# Altium project Pinger-V2.PrjPcb (part 1 of 2)
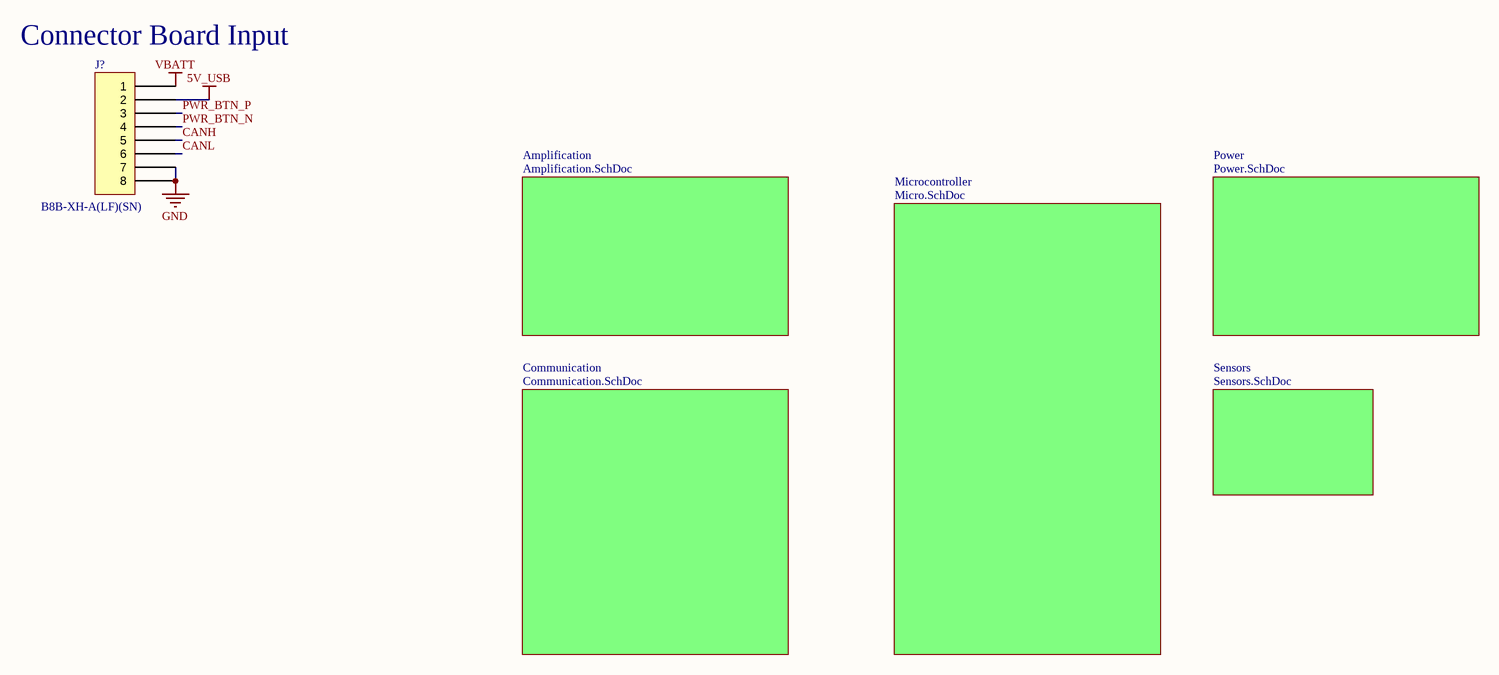
[diagram p0: Master.SchDoc]
Project: Pinger V2
5 sheets, 87 parts. Net scope: flat (ports and power ports of the same name join across sheets).
Board file: Pinger-V2 PCB.PcbDoc
Sheets:
  Master.SchDoc
    Microcontroller = Micro.SchDoc
    Power = Power.SchDoc
    Sensors = Sensors.SchDoc
    Communication = Communication.SchDoc

## Sheet Master.SchDoc
size 431 x 279 mm; SheetNumber: 1; SheetTotal: 6

### Parts
(Parts that share a designator on the sheet are numbered #1, #2 ... from top to bottom, then left to right.)
J?#1  B8B-XH-A(LF)(SN)  [JST XH B8B-XH-A]

### Sub-sheets
Amplification = Amplification.SchDoc (file not in this document): no entries
Communication = Communication.SchDoc: no entries
Microcontroller = Micro.SchDoc: no entries
Power = Power.SchDoc: no entries
Sensors = Sensors.SchDoc: no entries

### Nets
5V_USB: J?#1.2
GND: J?#1.7 J?#1.8
VBATT: J?#1.1
CANH: J?#1.5
CANL: J?#1.6
PWR_BTN_N: J?#1.4
PWR_BTN_P: J?#1.3

### Notes on the sheet
- (near J?#1) Connector Board Input
- DWG. NO.
- REV.
- SHT.
- THIS DOCUMENT AND THE DATA DISCLOSED HEREIN OR HEREWITH IS THE PROPERTY OF ALTIUM LIMITED AND MAY BE FREELY DISTRIBUTED IN WHOLE. NO RIGHTS ARE RESERVED OR EXPRESS OR IMPLIED WARANTEE GIVEN.
- REVISION
- DESCRIPTION
- DATE
- APPROVED
- ENG:
- APPROVALS
- PROJECT
- DSN:
- CHK:
- REFERENCE DOCUMENTS
- PROJECT REVISION:
- TITLE
- DOCUMENT REVISION:
- DESIGN ITEM:
- BOM:
- FAB DWG:
- PCB DWG:
- ASSY DWG:
- SCALE:
- SIZE
- B
- CAGE CODE
- FILE NAME
- DWG NO.
- SHEET
- OF
- REV

### Library data of the parts
J?#1 = B8B-XH-A(LF)(SN): CONN HEADER VERT 8POS 2.5MM; Manufacturer: JST Sales America Inc.; Contact Length - Post: 0.134" (3.40mm); Current Rating (Amps): 3A; Material Flammability Rating: UL94 V-0; Number of Positions: 8; Number of Positions Loaded: All; Pitch - Mating: 0.098" (2.50mm); Shrouding: Shrouded - 4 Wall; Style: Board to Cable/Wire; Voltage Rating: 250V; Part Number: B8B-XH-A(LF)(SN); ComponentLink1Description: Datasheet; ComponentLink1URL: http://www.jst-mfg.com/product/pdf/eng/eXH.pdf; ComponentLink2Description: DigiKey Link; ComponentLink2URL: http://digikey.com/product-detail/en/jst-sales-america-inc/B8B-XH-A-LF-SN/455-2251-ND/1651049; Connector Type: Header; Contact Finish - Mating: Tin; Contact Finish - Post: Tin; Contact Material: Brass; Contact Shape: Square; Contact Type: Male Pin; Fastening Type: Detent Lock; Insulation Color: Natural; Insulation Height: 0.276" (7.00mm); Insulation Material: Polyamide (PA66), Nylon 6/6; LastUpdated: 2020-01-12 11:47:22 PM; Lifecycle Status: Active; Minimum Order: 1; Mounting Type: Through Hole; Number of Rows: 1; Operating Temperature: -25°C ~ 85°C; Packaging: Bulk; PartId: 73; Part Status: Active; Price: 0.36; Series: XH; Supplier 1: DigiKey; Supplier Part Number 1: 455-2251-ND; Termination: Press-Fit, Solder

## Sheet Micro.SchDoc
size 431 x 279 mm; SheetNumber: 3; SheetTotal: 6
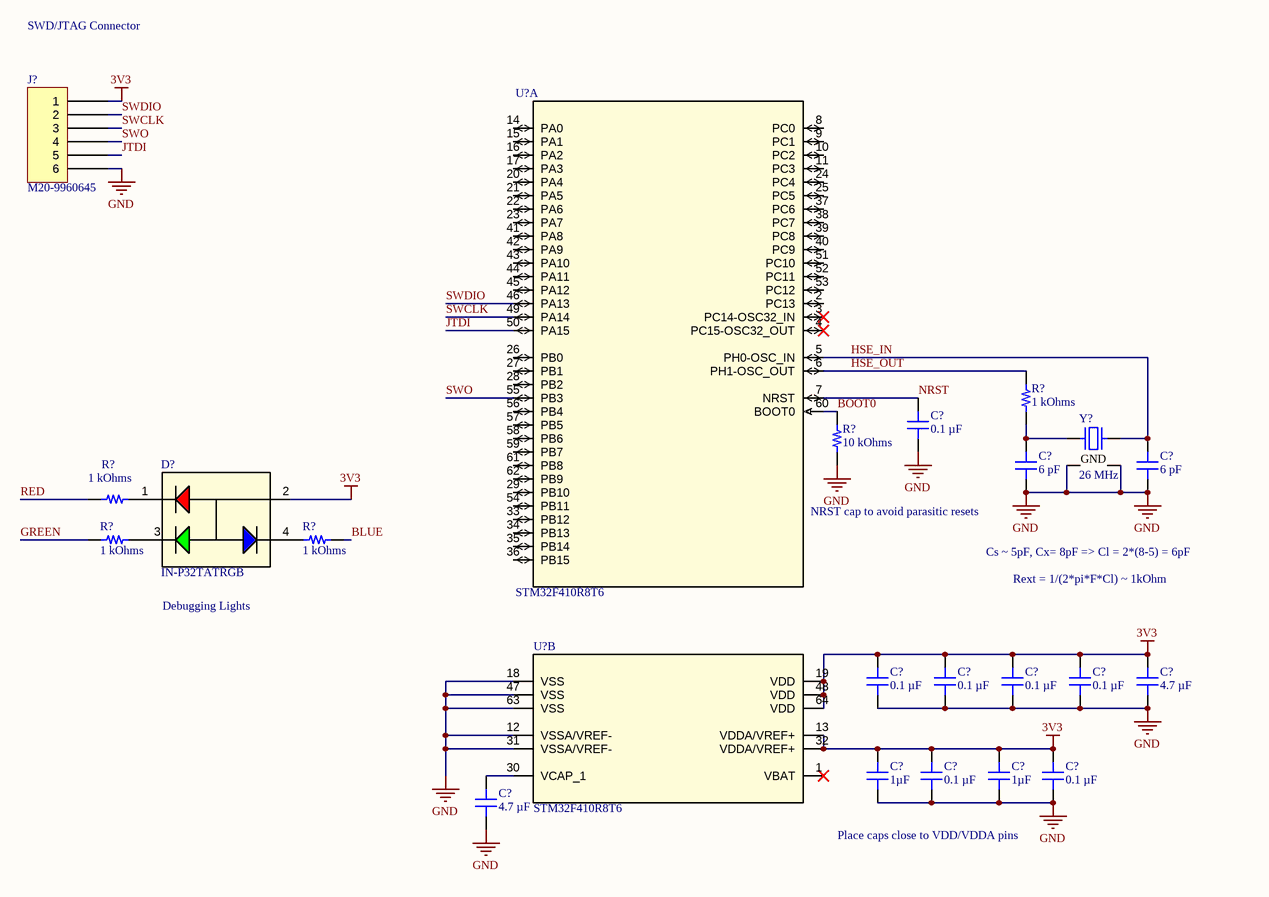
[diagram p1: Micro.SchDoc]

### Parts
(Parts that share a designator on the sheet are numbered #1, #2 ... from top to bottom, then left to right.)
C?#1  0.1 µF  [CAP 0603_1608]
C?#2  6 pF  [CAP 0603_1608]
C?#3  6 pF  [CAP 0603_1608]
C?#4  0.1 µF  [CAP 0603_1608]
C?#5  0.1 µF  [CAP 0603_1608]
C?#6  0.1 µF  [CAP 0603_1608]
C?#7  0.1 µF  [CAP 0603_1608]
C?#8  4.7 µF  [CAP 0603_1608]
C?#9  1µF  [CAP 0603_1608]
C?#10  0.1 µF  [CAP 0603_1608]
C?#11  1µF  [CAP 0603_1608]
C?#12  0.1 µF  [CAP 0603_1608]
C?#13  4.7 µF  [CAP 0603_1608]
D?#1  IN-P32TATRGB  [IN-P32TATRGB-Footprint-1]
J?#2  M20-9960645  [HARWIN M20-9960645]
R?#1  1 kOhms  [RES 0603_1608]
R?#2  10 kOhms  [RES 0603_1608]
R?#3  1 kOhms  [RES 0603_1608]
R?#4  1 kOhms  [RES 0603_1608]
R?#5  1 kOhms  [RES 0603_1608]
U?#1  STM32F410R8T6  [STM32F410R8T6-Footprint-1]  (part A of 2)
U?#2  STM32F410R8T6  [STM32F410R8T6-Footprint-1]  (part B of 2)
Y?  26 MHz  [NDK NX3225GA]

### Nets
3V3: C?#4.2 C?#5.2 C?#6.2 C?#7.2 C?#8.2 C?#9.2 C?#10.2 C?#11.2 C?#12.2 D?#1.2 J?#2.1 U?#2.13(VDDA/VREF+) U?#2.19(VDD) U?#2.32(VDDA/VREF+) U?#2.48(VDD) U?#2.64(VDD)
GND: C?#1.1 C?#2.1 C?#3.1 C?#4.1 C?#5.1 C?#6.1 C?#7.1 C?#8.1 C?#9.1 C?#10.1 C?#11.1 C?#12.1 C?#13.1 J?#2.6 R?#2.1 U?#2.12(VSSA/VREF-) U?#2.18(VSS) U?#2.31(VSSA/VREF-) U?#2.47(VSS) U?#2.63(VSS) Y?.2(GND) Y?.4(GND)
BLUE: R?#5.2
BOOT0: R?#2.2 U?#1.60(BOOT0)
GREEN: R?#4.1
HSE_IN: C?#3.2 U?#1.5(PH0-OSC_IN) Y?.3
HSE_OUT: R?#1.2 U?#1.6(PH1-OSC_OUT)
JTDI: J?#2.5 U?#1.50(PA15)
NRST: C?#1.2 U?#1.7(NRST)
RED: R?#3.1
SWCLK: J?#2.3 U?#1.49(PA14)
SWDIO: J?#2.2 U?#1.46(PA13)
SWO: J?#2.4 U?#1.55(PB3)
NetC?#2_2: C?#2.2 R?#1.1 Y?.1
NetC?#13_2: C?#13.2 U?#2.30(VCAP_1)
NetD?#1_1: D?#1.1 R?#3.2
NetD?#1_4: D?#1.4 R?#5.1

Not connected (* = marked no-connect by the designer): D?#1 3; R?#4 2; U?#1 2(PC13) 3(PC14-OSC32_IN)* 4(PC15-OSC32_OUT)* 8(PC0) 9(PC1) 10(PC2) 11(PC3) 14(PA0) 15(PA1) 16(PA2) 17(PA3) 20(PA4) 21(PA5) 22(PA6) 23(PA7) 24(PC4) 25(PC5) 26(PB0) 27(PB1) 28(PB2) 29(PB10) 33(PB12) 34(PB13) 35(PB14) 36(PB15) 37(PC6) 38(PC7) 39(PC8) 40(PC9) 41(PA8) 42(PA9) 43(PA10) 44(PA11) 45(PA12) 51(PC10) 52(PC11) 53(PC12) 54(PB11) 56(PB4) 57(PB5) 58(PB6) 59(PB7) 61(PB8) 62(PB9); U?#2 1(VBAT)*

### Notes on the sheet
- SWD/JTAG Connector
- (near U?#1) NRST cap to avoid parasitic resets
- Cs ~ 5pF, Cx= 8pF => Cl = 2*(8-5) = 6pF
- Debugging Lights
- Rext = 1/(2*pi*F*Cl) ~ 1kOhm
- (near C?#10) Place caps close to VDD/VDDA pins
- DWG. NO.
- REV.
- SHT.
- THIS DOCUMENT AND THE DATA DISCLOSED HEREIN OR HEREWITH IS THE PROPERTY OF ALTIUM LIMITED AND MAY BE FREELY DISTRIBUTED IN WHOLE. NO RIGHTS ARE RESERVED OR EXPRESS OR IMPLIED WARANTEE GIVEN.
- REVISION
- DESCRIPTION
- DATE
- APPROVED
- ENG:
- APPROVALS
- PROJECT
- DSN:
- CHK:
- REFERENCE DOCUMENTS
- PROJECT REVISION:
- TITLE
- DOCUMENT REVISION:
- DESIGN ITEM:
- BOM:
- FAB DWG:
- PCB DWG:
- ASSY DWG:
- SCALE:
- SIZE
- B
- CAGE CODE
- FILE NAME
- DWG NO.
- SHEET
- OF
- REV

### Library data of the parts
C?#1 C?#4-C?#7 C?#10 C?#12 = CGA3E2X7R1H104K080AE: CAP CER 0.1UF 50V X7R 0603; manufacturer: TDK Corporation; Tolerance: ±10%; Part Number: CGA3E2X7R1H104K080AE; Value: 0.1 µF; Applications: Automotive, Boardflex Sensitive; Capacitance: 0.1 µF; componentlink1description: Datasheet; componentlink1url: https://product.tdk.com/info/en/catalog/datasheets/mlcc_automotive_soft_en.pdf?ref_disty=digikey; componentlink2description: DigiKey Link; componentlink2url: https://www.digikey.com/en/products/detail/tdk-corporation/CGA3E2X7R1H104K080AE/4490594; Device Package: 0603 (1608 Metric); Features: Soft Termination; lastupdated: 2022-09-19 1:01:18 PM; Lifecycle Status: Active; Minimum Order: 1; Mounting Type: Surface Mount, MLCC; Operating Temperature: -55°C ~ 125°C; Package / Case: 0603 (1608 Metric); packaging: TapeAndReel; partid: 2715; Part Status: Active; price: 0.01; Ratings: AEC-Q200; series: CGA; Size / Dimension: 0.063" L x 0.031" W (1.60mm x 0.80mm); Supplier 1: DigiKey; Supplier Part Number 1: 445-15957-1-ND; Temperature Coefficient: X7R; Thickness (Max): 0.037" (0.95mm); Voltage - Rated: 50V
C?#2 C?#3 = CC0603CRNPO9BN6R0: CAP CER 6PF 50V C0G/NPO 0603; manufacturer: Yageo; Temperature Coefficient: C0G, NP0; Tolerance: ±0.25pF; Part Number: CC0603CRNPO9BN6R0; Value: 6 pF; Applications: General Purpose; Capacitance: 6 pF; componentlink1description: Datasheet; componentlink1url: https://www.yageo.com/upload/media/product/productsearch/datasheet/mlcc/UPY-GP_NP0_16V-to-50V_17.pdf; componentlink2description: DigiKey Link; componentlink2url: https://www.digikey.com/en/products/detail/yageo/CC0603CRNPO9BN6R0/5883458; Device Package: 0603 (1608 Metric); lastupdated: 2022-09-19 1:01:20 PM; Lifecycle Status: Active; Minimum Order: 1; Mounting Type: Surface Mount, MLCC; Operating Temperature: -55°C ~ 125°C; Package / Case: 0603 (1608 Metric); packaging: TapeAndReel; partid: 2229; Part Status: Active; price: 0.02; series: CC; Size / Dimension: 0.063" L x 0.031" W (1.60mm x 0.80mm); Supplier 1: DigiKey; Supplier Part Number 1: 311-3860-1-ND; Thickness (Max): 0.035" (0.90mm); Voltage - Rated: 50V
C?#8 C?#13 = CL10A475KA8NQNC: CAP CER 4.7UF 25V X5R 0603; manufacturer: Samsung Electro-Mechanics; Tolerance: ±10%; Part Number: CL10A475KA8NQNC; Value: 4.7 µF; Applications: General Purpose; Capacitance: 4.7 µF; componentlink1description: Datasheet; componentlink1url: http://www.samsungsem.com/kr/support/product-search/mlcc/CL10A475KA8NQNC.jsp; componentlink2description: DigiKey Link; componentlink2url: https://www.digikey.com/en/products/detail/samsung-electro-mechanics/CL10A475KA8NQNC/3887558; Device Package: 0603 (1608 Metric); lastupdated: 2022-09-19 1:01:20 PM; Lifecycle Status: Active; Minimum Order: 1; Mounting Type: Surface Mount, MLCC; Operating Temperature: -55°C ~ 85°C; Package / Case: 0603 (1608 Metric); packaging: TapeAndReel; partid: 2349; Part Status: Active; price: 0.06; series: CL; Size / Dimension: 0.063" L x 0.031" W (1.60mm x 0.80mm); Supplier 1: DigiKey; Supplier Part Number 1: 1276-1900-1-ND; Temperature Coefficient: X5R; Thickness (Max): 0.035" (0.90mm); Voltage - Rated: 25V
C?#9 C?#11 = 06033D105MAT2A: CAP CER 1UF 25V X5R 0603; manufacturer: AVX Corporation; Tolerance: ±20%; Part Number: 06033D105MAT2A; Value: 1µF; Applications: General Purpose; Capacitance: 1µF; componentlink1description: Datasheet; componentlink1url: http://datasheets.avx.com/cx5r.pdf; componentlink2description: DigiKey Link; componentlink2url: http://digikey.com/product-detail/en/avx-corporation/06033D105MAT2A/478-4531-1-ND/1645882; Device Package: 0603 (1608 Metric); lastupdated: 2020-09-02 1:03:35 AM; Lifecycle Status: Active; Minimum Order: 1; Mounting Type: Surface Mount, MLCC; Operating Temperature: -55°C ~ 85°C; Package / Case: 0603 (1608 Metric); packaging: TapeAndReel; partid: 2656; Part Status: Active; price: 0.11; series: -; Size / Dimension: 0.063" L x 0.032" W (1.60mm x 0.81mm); Supplier 1: DigiKey; Supplier Part Number 1: 478-4531-1-ND; Temperature Coefficient: X5R; Thickness (Max): 0.035" (0.90mm); Voltage - Rated: 25V
D?#1 = CMP-00060-1: Blue/Green/ Red Tri-Color LEDs; Dominant Wavelength: 468nm; Lens Style: Round,Flat; Test Current: 20mA; Luminous Intensity: 300mcd; Element Configuration: Common Anode; Forward Voltage: 3.2V; Lens Color: Clear; Viewing Angle: 120°; Color: Blue,Green,Red; Packaging: Cut Tape; Width: 2.8mm; Case/Package: PLCC; Series: IN-P32TA; Mounting Technology: Surface Mount; Height: 1.9mm; Lens Transparency: Clear; Pins: 4; Length: 3.2mm
J?#2 = M20-9960645: CONN HEADER R/A 6POS 2.54MM; Manufacturer: Harwin Inc.; Connector Type: Header, Cuttable; Contact Length - Mating: 0.240" (6.10mm); Contact Length - Post: 0.118" (3.00mm); Current Rating (Amps): 3A per Contact; Material Flammability Rating: UL94 V-0; Number of Positions: 6; Number of Positions Loaded: All; Pitch - Mating: 0.100" (2.54mm); Row Spacing - Mating: -40°C ~ 105°C; Shrouding: Unshrouded; Style: Board to Board or Cable; Part Number: M20-9960645; ComponentLink1Description: Datasheet; ComponentLink1URL: https://cdn.harwin.com/pdfs/Harwin_PC_Connectors_M20.pdf; ComponentLink2Description: DigiKey Link; ComponentLink2URL: https://www.digikey.com/en/products/detail/harwin-inc/M20-9960645/3728211; Contact Finish - Mating: Gold; Contact Material: Brass; Contact Shape: Square; Contact Type: Male Pin; Fastening Type: Push-Pull; Insulation Color: Black; Insulation Height: 0.100" (2.54mm); Insulation Material: Polyamide (PA6T), Nylon 6T; LastUpdated: 2022-09-21 7:23:50 PM; Lifecycle Status: Active; Minimum Order: 1; Mounting Type: Through Hole, Right Angle; Number of Rows: 1; Operating Temperature: -40°C ~ 105°C; Packaging: Bulk; PartId: 169; Part Status: Active; Price: 0.16; Series: M20; Supplier 1: DigiKey; Supplier Part Number 1: 952-2247-ND; Termination: Solder
R?#1 = RT0603FRE071KL: RES SMD 1K OHM 1% 1/10W 0603; Manufacturer: Yageo; Power (Watts): 0.1W, 1/10W; Temperature Coefficient: ±50ppm/°C; Part Number: RT0603FRE071KL; Value: 1 kOhms; ComponentLink1Description: Datasheet; ComponentLink1URL: https://www.yageo.com/upload/media/product/productsearch/datasheet/rchip/PYu-RT_1-to-0.01_RoHS_L_11.pdf; ComponentLink2Description: DigiKey Link; ComponentLink2URL: https://www.digikey.com/en/products/detail/yageo/RT0603FRE071KL/1075188; Composition: Thin Film; Device Package: 0603 (1608 Metric); Height - Seated (Max): 0.022" (0.55mm); LastUpdated: 2022-09-19 1:22:31 PM; Lifecycle Status: Active; Minimum Order: 1; Number of Terminations: 2; Operating Temperature: -55°C ~ 155°C; Package / Case: 0603 (1608 Metric); Packaging: TapeAndReel; PartId: 5672; Part Status: Active; Price: 0.01; Resistance: 1 kOhms; Series: RT; Size / Dimension: 0.063" L x 0.031" W (1.60mm x 0.80mm); Supplier 1: DigiKey; Supplier Part Number 1: YAG2323CT-ND; Supplier Device Package: 0603; Tolerance: ±1%
R?#2 = RT0603FRE0710KL: RES SMD 10K OHM 1% 1/10W 0603; Manufacturer: Yageo; Power (Watts): 0.1W, 1/10W; Temperature Coefficient: ±50ppm/°C; Part Number: RT0603FRE0710KL; Value: 10 kOhms; ComponentLink1Description: Datasheet; ComponentLink1URL: https://www.yageo.com/upload/media/product/productsearch/datasheet/rchip/PYu-RT_1-to-0.01_RoHS_L_11.pdf; ComponentLink2Description: DigiKey Link; ComponentLink2URL: https://www.digikey.com/en/products/detail/yageo/RT0603FRE0710KL/1075040; Composition: Thin Film; Device Package: 0603 (1608 Metric); Height - Seated (Max): 0.022" (0.55mm); LastUpdated: 2022-09-19 1:22:31 PM; Lifecycle Status: Active; Minimum Order: 1; Number of Terminations: 2; Operating Temperature: -55°C ~ 155°C; Package / Case: 0603 (1608 Metric); Packaging: TapeAndReel; PartId: 5671; Part Status: Active; Price: 0.01; Resistance: 10 kOhms; Series: RT; Size / Dimension: 0.063" L x 0.031" W (1.60mm x 0.80mm); Supplier 1: DigiKey; Supplier Part Number 1: YAG2321CT-ND; Supplier Device Package: 0603; Tolerance: ±1%
R?#3-R?#5 = CRCW06031K00FKEB: RES SMD 1K OHM 1% 1/10W 0603; Manufacturer: Vishay Dale; Power (Watts): 0.1W, 1/10W; Temperature Coefficient: ±100ppm/°C; Part Number: CRCW06031K00FKEB; Value: 1 kOhms; ComponentLink1Description: Datasheet; ComponentLink1URL: http://www.vishay.com/docs/20035/dcrcwe3.pdf; ComponentLink2Description: DigiKey Link; ComponentLink2URL: http://digikey.com/product-detail/en/vishay-dale/CRCW06031K00FKEB/541-2985-1-ND/6073628; Composition: Thick Film; Device Package: 0603 (1608 Metric); Features: Automotive AEC-Q200; Height - Seated (Max): 0.020" (0.50mm); LastUpdated: 2022-09-19 1:22:33 PM; Lifecycle Status: Active; Minimum Order: 1; Number of Terminations: 2; Operating Temperature: -55°C ~ 155°C; Package / Case: 0603 (1608 Metric); Packaging: CutTape; PartId: 5123; Part Status: Active; Price: 0.10; Ratings: AEC-Q200; Resistance: 1 kOhms; Series: CRCW; Size / Dimension: 0.063" L x 0.033" W (1.60mm x 0.85mm); Supplier 1: DigiKey; Supplier Part Number 1: 541-2985-1-ND; Supplier Device Package: 0603; Tolerance: ±1%
U?#1 U?#2 = CMP-00059-1: MCU 32-bit ARM Cortex M4 RISC 64KB Flash 3.3V 64-Pin LQFP Frame; Frequency: 100MHz; Number of I/Os: 50; Interface: I2C,SPI,IrDA,UART,USART; Peripherals: Brown-out Detect/Reset,POR,PWM,WDT,DMA; Oscillator Type: Internal; Series: STM32F4; Memory Type: FLASH; Min Operating Temperature: -40°C; Case/Package: LQFP; Packaging: Tray; Memory Size: 64KB; Core Architecture: ARM; RoHS Compliant: Yes; Max Operating Temperature: 85°C
Y? = NX3225GA-26.000M-STD-CRG-2: CRYSTAL 26.0000MHZ 8PF SMD; Manufacturer: NDK America, Inc.; ESR (Equivalent Series Resistance): 50 Ohms; Frequency Stability: ±30ppm; Frequency Tolerance: ±20ppm; Operating Mode: Fundamental; Part Number: NX3225GA-26.000M-STD-CRG-2; ComponentLink1Description: Datasheet; ComponentLink1URL: http://www.ndk.com/images/products/catalog/c_NX3225GA-STD-CRG-2_e.pdf; ComponentLink2Description: DigiKey Link; ComponentLink2URL: https://www.digikey.com/en/products/detail/ndk-america-inc/NX3225GA-26-000M-STD-CRG-2/5022965; Frequency: 26 MHz; Height - Seated (Max): 0.035" (0.90mm); LastUpdated: 2022-09-19 1:51:54 PM; Lifecycle Status: Active; Load Capacitance: 8pF; Minimum Order: 1; Mounting Type: Surface Mount; Operating Temperature: -40°C ~ 85°C; Package / Case: 4-SMD, No Lead; Packaging: TapeAndReel; PartId: 539; Part Status: Active; Price: 0.27; Series: NX3225GA; Size / Dimension: 0.126" L x 0.098" W (3.20mm x 2.50mm); Supplier 1: DigiKey; Supplier Part Number 1: 644-1261-1-ND; Type: MHz Crystal; Value: 26 MHz